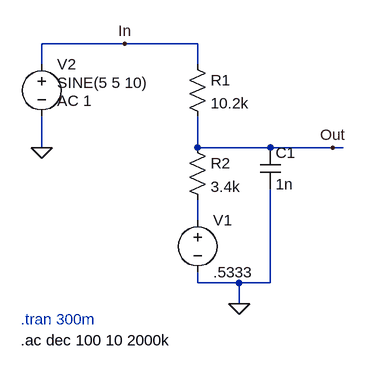
[diagram p0: schematic Filter SPICE.asc]
Filter SPICE.asc, the LTspice schematic file:
Version 4.1
SHEET 1 880 680
WIRE 0 0 -128 0
WIRE 112 0 0 0
WIRE -128 32 -128 0
WIRE 112 32 112 0
WIRE -128 160 -128 112
WIRE 112 160 112 112
WIRE 224 160 112 160
WIRE 320 160 224 160
WIRE 336 160 320 160
WIRE 112 272 112 240
WIRE 112 368 112 352
WIRE 176 368 112 368
WIRE 224 368 224 224
WIRE 224 368 176 368
WIRE 176 400 176 368
FLAG 176 400 0
FLAG -128 160 0
FLAG 0 0 In
FLAG 320 160 Out
SYMBOL cap 208 160 R0
SYMATTR InstName C1
SYMATTR Value 1n
SYMBOL res 96 16 R0
SYMATTR InstName R1
SYMATTR Value 10.2k
SYMATTR SpiceLine tol=0.1
SYMBOL res 96 144 R0
SYMATTR InstName R2
SYMATTR Value 3.4k
SYMATTR SpiceLine tol=0.1
SYMBOL voltage 112 256 R0
WINDOW 123 0 0 Left 0
WINDOW 39 0 0 Left 0
SYMATTR InstName V1
SYMATTR Value .5333
SYMBOL voltage -128 16 R0
WINDOW 3 24 44 Left 2
WINDOW 123 24 72 Left 2
WINDOW 39 0 0 Left 0
SYMATTR InstName V2
SYMATTR Value SINE(5 5 10)
SYMATTR Value2 AC 1
TEXT -160 424 Left 2 ;.tran 300m
TEXT -160 456 Left 2 !.ac dec 100 10 2000k

The netlist it stands for:
* Filter SPICE.asc
C1 Out 0 1n
R1 In Out 10.2k tol=0.1
R2 Out N001 3.4k tol=0.1
V1 N001 0 .5333
V2 In 0 SINE(5 5 10) AC 1
* .tran 300m
.ac dec 100 10 2000k
.backanno
.end